# EAGLE schematic Wireless Estop (EAGLE 9.2.1)
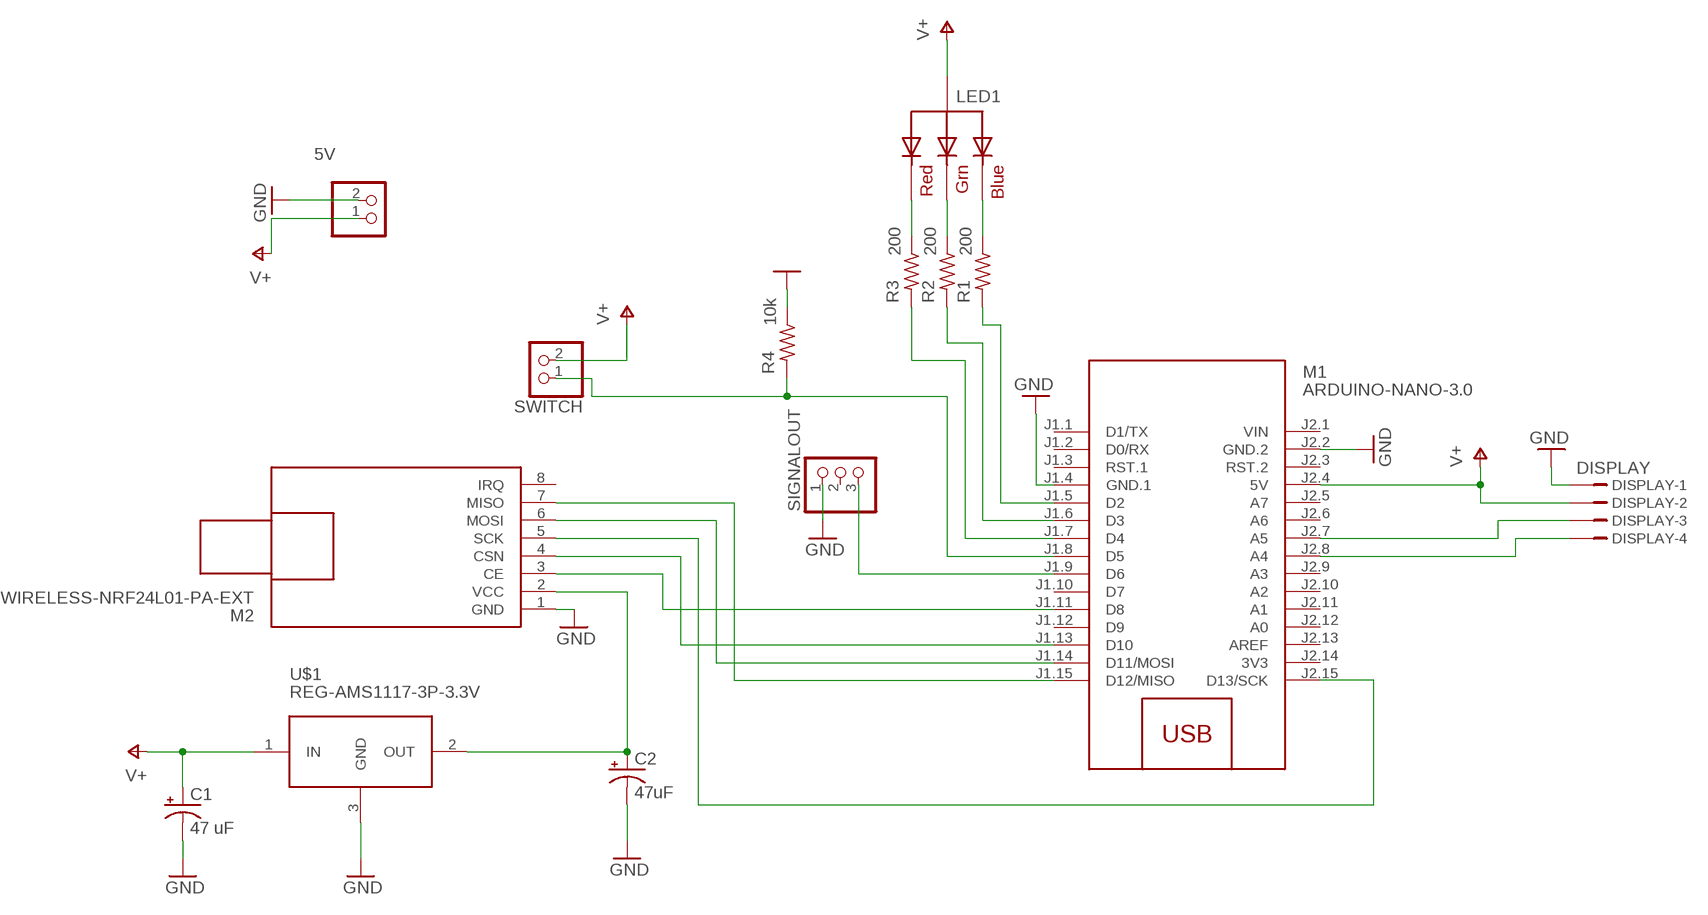
[diagram p0: schematic, sheet 1]

## Parts
5V  JST_2PIN-THM  [JST-PH-2-THM]
C1  47 uF  CPOL-USE2.5-5  [E2,5-5]
C2  47uF  CPOL-USE2.5-5  [E2,5-5]
DISPLAY  DISPLAY  B4B-ZR  [B4B-ZR]
LED1  RGBLED_CA-5MM  [LED5MMRGB]
M1  ARDUINO-NANO-3.0  [ARDUINO-NANO-3.0]
M2  WIRELESS-NRF24L01-PA-EXT  [WIRELESS-NRF24L01-PA-EXT]
R1  200  FLIPFLOP-RES  [0805-THM]
R2  200  FLIPFLOP-RES  [0805-THM]
R3  200  FLIPFLOP-RES  [0805-THM]
R4  10k  FLIPFLOP-RES  [0805-THM]
SIGNALOUT  PINHD-1X3  [1X03]
SWITCH  PINHD-1X2  [1X02]
U$1  REG-AMS1117-3P-3.3V  [REG-AMS1117-3P]

## Nets
GND: 5V.2 C1.- C2.- DISPLAY.1 M1.J1.4(GND.1) M1.J2.2(GND.2) M2.1(GND) R4.1 SIGNALOUT.1 U$1.3(GND)
N$1: M1.J1.11(D8) M2.3(CE)
N$2: M1.J1.13(D10) M2.4(CSN)
N$3: M1.J2.15(D13/SCK) M2.5(SCK)
N$5: M1.J1.14(D11/MOSI) M2.6(MOSI)
N$6: M1.J1.15(D12/MISO) M2.7(MISO)
N$7: C2.+ M2.2(VCC) U$1.2(OUT)
N$8: LED1.4(BLUE) R1.1
N$9: LED1.3(GREEN) R2.1
N$10: LED1.1(RED) R3.1
N$11: M1.J1.5(D2) R1.2
N$12: M1.J1.6(D3) R2.2
N$13: M1.J1.7(D4) R3.2
N$14: DISPLAY.4 M1.J2.8(A4)
N$15: DISPLAY.3 M1.J2.7(A5)
N$16: M1.J1.8(D5) R4.2 SWITCH.1
N$17: M1.J1.9(D6) SIGNALOUT.3
V+: 5V.1 C1.+ DISPLAY.2 LED1.2(VCC) M1.J2.4(5V) SWITCH.2 U$1.1(IN)
Unconnected: M1.J1.1(D1/TX) M1.J1.2(D0/RX) M1.J1.3(RST.1) M1.J1.10(D7) M1.J1.12(D9) M1.J2.3(RST.2) M1.J2.5(A7) M1.J2.6(A6) M1.J2.9(A3) M1.J2.10(A2) M1.J2.11(A1) M1.J2.12(A0) M1.J2.13(AREF) M2.8(IRQ) SIGNALOUT.2

## Power pins joined to a net without a drawn wire
3V3: M1.J2.14(3V3)
VIN: M1.J2.1(VIN)

## Library data of the parts
5V = adafruit:JST_2PIN: JST 2-Pin Connectors of various flavors SMT-RA (S2B-PH-SM4) 4UConnector #17311 SMT (B2B-PH-SM4) THM-RA (S2B-PH) THM (B2B-PH)
C1 C2 = rcl:CPOL-US: POLARIZED CAPACITOR, American symbol; SPICEPREFIX: C
DISPLAY = con-jst:?4B-ZR: ZH CONNECTOR 1.5 mm, 4 pin 1 row Source: http://www.jst.com .. eZH.pdf; MF: FARNELL; MPN: B4B-ZR(LF)(SN); OC_FARNELL: 1830916; OC_NEWARK: 37K9960
LED1 = adafruit:RGBLED_CA: RGB LED, common-anode 5MM Staggered pins 5mm Piranha package http://www.ladyada.net/library/pcb/eaglelibrary.html
M1 = diy-modules:ARDUINO-NANO-3.0: Arduino Nano 3.0 and compatible devices More details available here: https://www.arduino.cc/en/Main/ArduinoBoardNano Click here to find device on ebay.com <http://www.ebay.com/sch/arduino+nano>
M2 = diy-modules:WIRELESS-NRF24L01-PA-EXT: 2.4 GHz Wireless Module based on NRF24L01 chip with preamplifier and external antenna Click here to find device on ebay.com <http://www.ebay.com/sch/nrf24l01+pa+lna+sma>
R1-R4 = adafruit:FLIPFLOP-RES: Flip Flop resistor An 0805 resistor inside a standard 1/4W 5% resistor. Makes for easy mods
SIGNALOUT = adafruit:PINHD-1X3: PIN HEADER
SWITCH = pinhead:PINHD-1X2: PIN HEADER
U$1 = diy-modules:REG-AMS1117-3P-*: Linear Regulator based on AMS1117 chip 3-pin version AMS1117 datasheet is available here: http://www.advanced-monolithic.com/pdf/ds1117.pdf Click here to find device on ebay.com <http://www.ebay.com/sch/ams1117+module> Note: There are many variants. Search for the proper version.

## Net classes
0 default: width 0.305 mm, drill 0.508 mm, clearance 0.254 mm